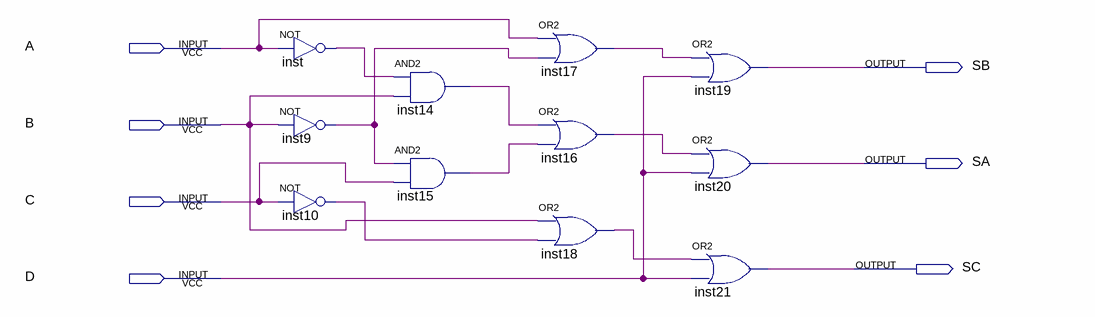
[diagram p0: schematic sheet]
// Quartus schematic Semaforo_Legal.bdf as structural Verilog: 11 symbols, 7 pins
module Semaforo_Legal (
  input  A,
  input  B,
  input  C,
  input  D,
  output SB,
  output SA,
  output SC
);

  wire inst9_out, inst10_out, inst14_out, inst15_out, inst16_out, inst17_out, inst18_out, inst_out;

  not inst (inst_out, A);
  not inst9 (inst9_out, B);
  not inst10 (inst10_out, C);
  and inst14 (inst14_out, inst_out, B);
  and inst15 (inst15_out, inst9_out, C);
  or inst17 (inst17_out, A, inst9_out);
  or inst16 (inst16_out, inst14_out, inst15_out);
  or inst18 (inst18_out, B, inst10_out);
  or inst19 (SB, inst17_out, D);
  or inst20 (SA, inst16_out, D);
  or inst21 (SC, inst18_out, D);
endmodule
